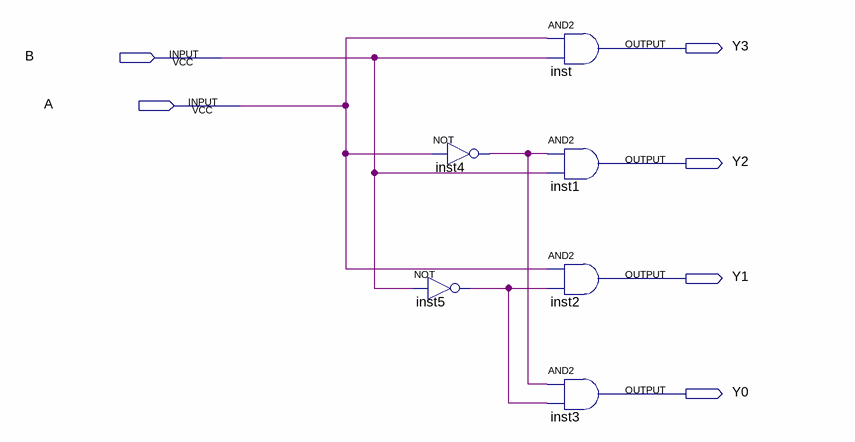
[diagram p0: schematic sheet]
// Quartus schematic 24trans.bdf as structural Verilog: 6 symbols, 6 pins
module \24trans  (
  input  B,
  input  A,
  output Y3,
  output Y2,
  output Y1,
  output Y0
);

  wire inst4_out, inst5_out;

  not inst4 (inst4_out, A);
  not inst5 (inst5_out, B);
  and inst (Y3, A, B);
  and inst1 (Y2, inst4_out, B);
  and inst2 (Y1, A, inst5_out);
  and inst3 (Y0, inst4_out, inst5_out);
endmodule
